# EAGLE design UPDuino Camera Adapter 2 himax (EAGLE 9.1.0)
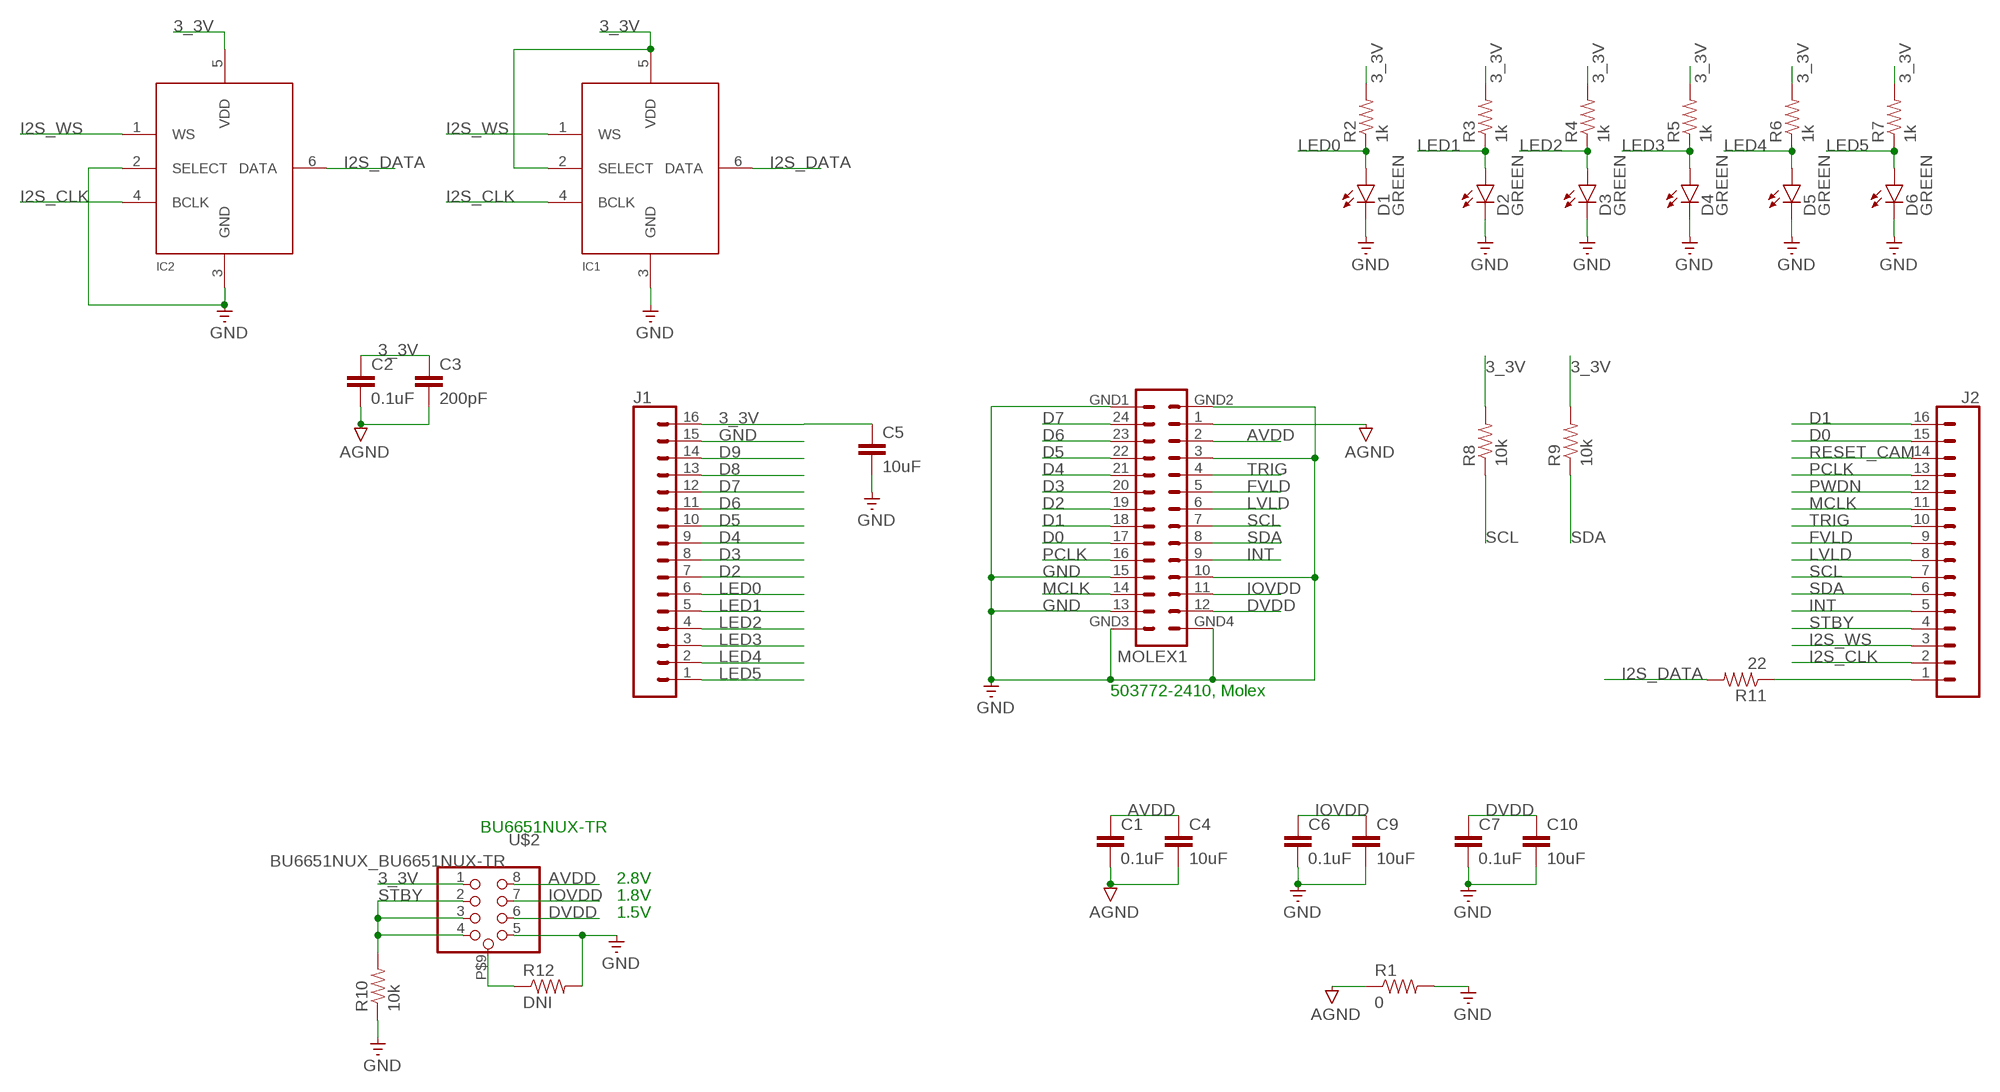
[diagram p0: schematic, sheet 1]

## Parts
C1  0.1uF  0.1UF-0603-25V-(+80/-20%)  [0603]
C2  0.1uF  0.1UF-0603-25V-(+80/-20%)  [0603]
C3  200pF  10UF-0603-6.3V-20%  [0603]
C4  10uF  10UF-0603-6.3V-20%  [0603]
C5  10uF  10UF-0603-6.3V-20%  [0603]
C6  0.1uF  0.1UF-0603-25V-(+80/-20%)  [0603]
C7  0.1uF  0.1UF-0603-25V-(+80/-20%)  [0603]
C9  10uF  10UF-0603-6.3V-20%  [0603]
C10  10uF  10UF-0603-6.3V-20%  [0603]
D1  GREEN  LED-GREEN0603  [LED-0603]
D2  GREEN  LED-GREEN0603  [LED-0603]
D3  GREEN  LED-GREEN0603  [LED-0603]
D4  GREEN  LED-GREEN0603  [LED-0603]
D5  GREEN  LED-GREEN0603  [LED-0603]
D6  GREEN  LED-GREEN0603  [LED-0603]
IC1  MIC_I2S_SPH0645  [SPH0645LM4H]
IC2  MIC_I2S_SPH0645  [SPH0645LM4H]
J1  CONN_16  [1X16]
J2  CONN_16  [1X16]
MOLEX1  MOLEX-5037722410_MOLEX  [MOLEX-5037722410_MOLEX]
R1  0  RESISTOR0603  [0603-RES]
R2  1k  RESISTOR0603  [0603-RES]
R3  1k  RESISTOR0603  [0603-RES]
R4  1k  RESISTOR0603  [0603-RES]
R5  1k  RESISTOR0603  [0603-RES]
R6  1k  RESISTOR0603  [0603-RES]
R7  1k  RESISTOR0603  [0603-RES]
R8  10k  RESISTOR0603  [0603-RES]
R9  10k  RESISTOR0603  [0603-RES]
R10  10k  RESISTOR0603  [0603-RES]
R11  22  RESISTOR0603  [0603-RES]
R12  DNI  RESISTOR0603  [0603-RES]
U$2  BU6651NUX_BU6651NUX-TR  [BU6651NUX_BU6651NUX-TR]

## Nets
3_3V: C2.1 C3.1 C5.1 IC1.2(SELECT) IC1.5(VDD) IC2.5(VDD) J1.16 R2.2 R3.2 R4.2 R5.2 R6.2 R7.2 R8.2 R9.2 U$2.1
AGND: C1.2 C2.2 C3.2 C4.2 MOLEX1.1 R1.1
AVDD [VCC2]: C1.1 C4.1 MOLEX1.2 U$2.8
D0: J2.15 MOLEX1.17
D1: J2.16 MOLEX1.18
D2: J1.7 MOLEX1.19
D3: J1.8 MOLEX1.20
D4: J1.9 MOLEX1.21
D5: J1.10 MOLEX1.22
D6: J1.11 MOLEX1.23
D7: J1.12 MOLEX1.24
D8: J1.13
D9: J1.14
DVDD: C7.1 C10.1 MOLEX1.12 U$2.6
FVLD: J2.9 MOLEX1.5
GND [default]: C5.2 C6.2 C7.2 C9.2 C10.2 D1.C D2.C D3.C D4.C D5.C D6.C IC1.3(GND) IC2.2(SELECT) IC2.3(GND) J1.15 MOLEX1.3 MOLEX1.10 MOLEX1.13 MOLEX1.15 MOLEX1.GND1 MOLEX1.GND2 MOLEX1.GND3 MOLEX1.GND4 R1.2 R10.1 R12.2 U$2.5
I2S_CLK: IC1.4(BCLK) IC2.4(BCLK) J2.2
I2S_DATA: IC1.6(DATA) IC2.6(DATA) R11.2
I2S_WS: IC1.1(WS) IC2.1(WS) J2.3
INT: J2.5 MOLEX1.9
IOVDD: C6.1 C9.1 MOLEX1.11 U$2.7
LED0: D1.A J1.6 R2.1
LED1: D2.A J1.5 R3.1
LED2: D3.A J1.4 R4.1
LED3: D4.A J1.3 R5.1
LED4: D5.A J1.2 R6.1
LED5: D6.A J1.1 R7.1
LVLD: J2.8 MOLEX1.6
MCLK: J2.11 MOLEX1.14
N$1: J2.1 R11.1
N$2: R12.1 U$2.P$9
PCLK: J2.13 MOLEX1.16
PWDN: J2.12
RESET_CAM: J2.14
SCL: J2.7 MOLEX1.7 R8.1
SDA: J2.6 MOLEX1.8 R9.1
STBY: J2.4 R10.2 U$2.2 U$2.3 U$2.4
TRIG: J2.10 MOLEX1.4

## Notes on the sheet
- 503772-2410, Molex
- BU6651NUX-TR
- 2.8V
- 1.8V
- 1.5V

## Library data of the parts
C1 C2 C6 C7 = SparkFun-Capacitors:0.1UF: 0.1µF ceramic capacitors A capacitor is a passive two-terminal electrical component used to store electrical energy temporarily in an electric field.; PROD_ID: CAP-00810
C3 = SparkFun-Capacitors:10UF: 10.0µF ceramic capacitors A capacitor is a passive two-terminal electrical component used to store electrical energy temporarily in an electric field.; PROD_ID: CAP-11015; VALUE: 10uF
C4 C5 C9 C10 = SparkFun-Capacitors:10UF: 10.0µF ceramic capacitors A capacitor is a passive two-terminal electrical component used to store electrical energy temporarily in an electric field.; PROD_ID: CAP-11015
D1-D6 = SparkFun-LED:LED-GREEN: Various green LEDs Green LEDs used in SFE Production 0603- DIO-00821 LARGE- DIO-00862 LILYPAD- DIO-09910; PROD_ID: DIO-00821
IC1 IC2 = microbuilder:MIC_I2S
J1 J2 = SparkFun-Connectors:CONN_16: Multi connection point. Often used as Generic Header-pin footprint for 0.1 inch spaced/style header connections On any of the 0.1 inch spaced packages, you can populate with these: Break Away Headers - Straight <https://www.sparkfun.com/products/116> (PRT-00116) Break Away Male Headers - Right Angle <https://www.sparkfun.com/products/553> (PRT-00553) Female Headers <https://www.sparkfun.com/products/115> (PRT-00115) Break Away Headers - Machine Pin <https://www.sparkfun.com/products/117> (PRT-00117) Break Away Female Headers - Swiss Machine Pin <https://www.sparkfun.com/products/743> (PRT-00743) For SCREWTERMINALS and SPRING TERMINALS visit here: Screw Terimnals on SparkFun.com <https://www.sparkfun.com/search/results?term=Screw+Terminals> (5mm/3.5mm/2.54mm spacing) This device is also useful as a general connection point to wire up your design to another part of your project. Our various solder wires solder well into these plated through hole pads. Hook-Up Wire - Assortment (Stranded, 22 AWG) <https://www.sparkfun.com/products/11375> (PRT-11375) Hook-Up Wire - Assortment (Solid Core, 22 AWG) <https://www.sparkfun.com/products/11367> (PRT-11367) View the entire wire category on our website here <https://www.sparkfun.com/categories/141> Special notes: Molex polarized connector foot print use with SKU : PRT-08231 with associated crimp pins and housings. 1MM SMD Version SKU: PRT-10208 NOTES ON THE VARIANTS LOCK and LOCK_LONGPADS... This footprint was designed to help hold the alignment of a through-hole component (i.e. 6-pin header) while soldering it into place. You may notice that each hole has been shifted either up or down by 0.005 of an inch from it's more standard position (which is a perfectly straight line). This slight alteration caused the pins (the squares in the middle) to touch the edges of the holes. Because they are alternating, it causes a "brace" to hold the component in place. 0.005 has proven to be the perfect amount of "off-center" position when using our standard breakaway headers. Although looks a little odd when you look at the bare footprint, once you have a header in there, the alteration is very hard to notice. Also,if you push a header all the way into place, it is covered up entirely on the bottom side.
MOLEX1 = molex:MOLEX-5037722410_MOLEX
R1-R12 = SparkFun-Resistors:RESISTOR: Resistor Basic schematic elements and footprints for 0603, 1206, and PTH resistors.
U$2 = UPDuino Camera Adapter 2 himax:BU6651NUX_BU6651NUX-TR

## Board
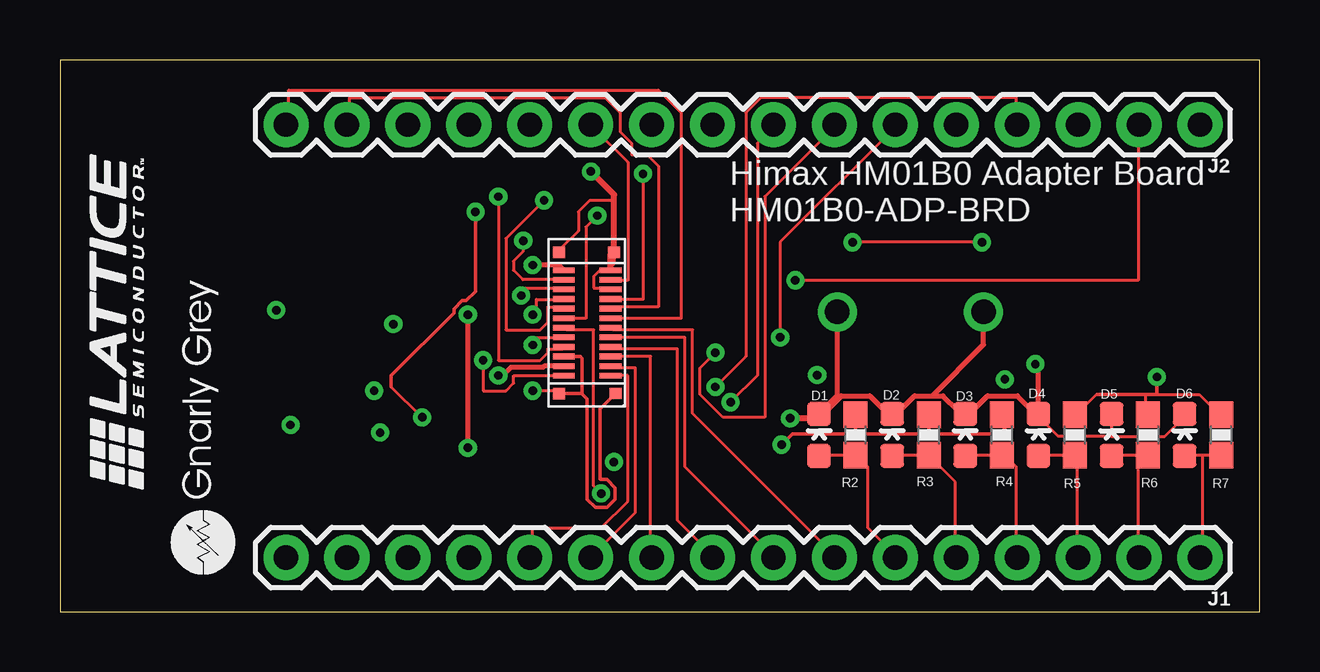
[diagram p1: board, top side]
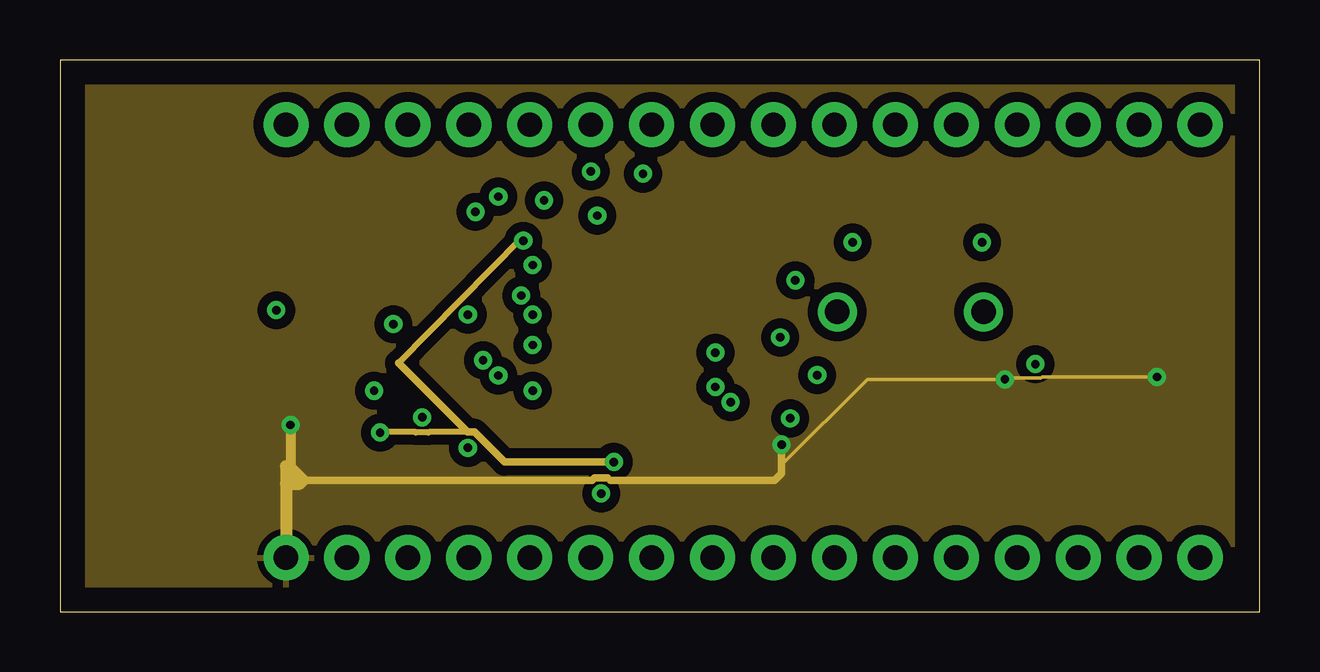
[diagram p2: board, inner layer vcc]
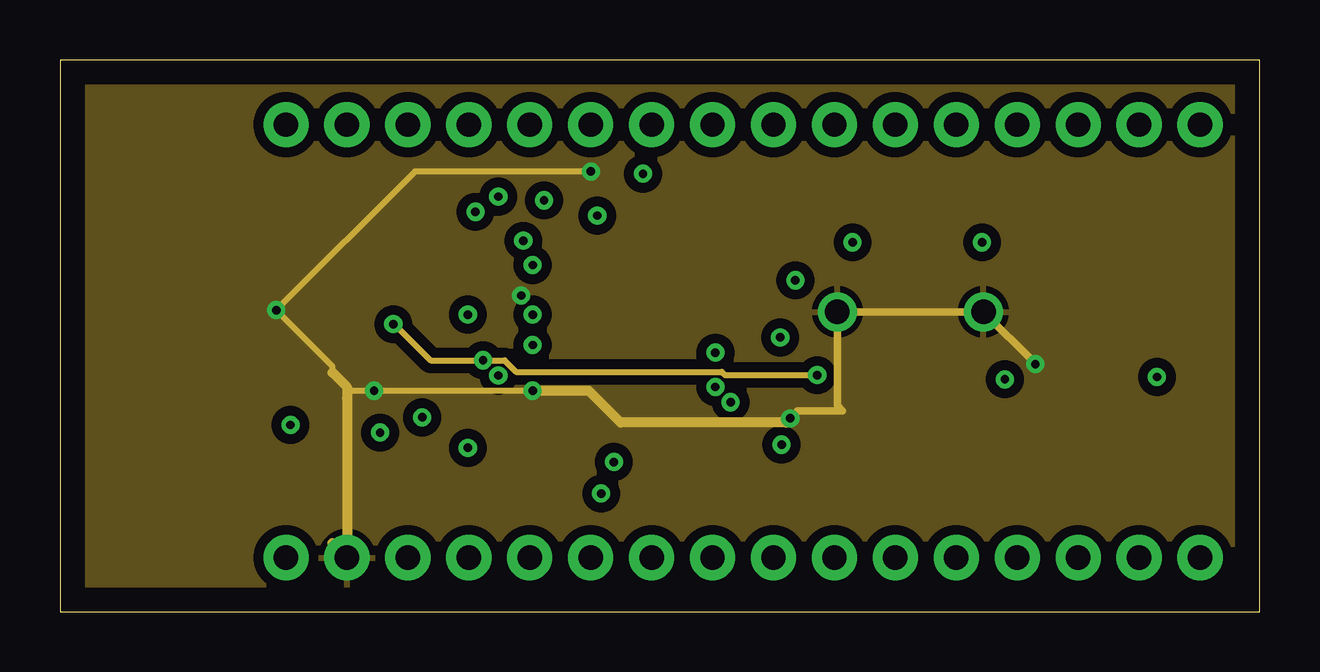
[diagram p3: board, inner layer gnd]
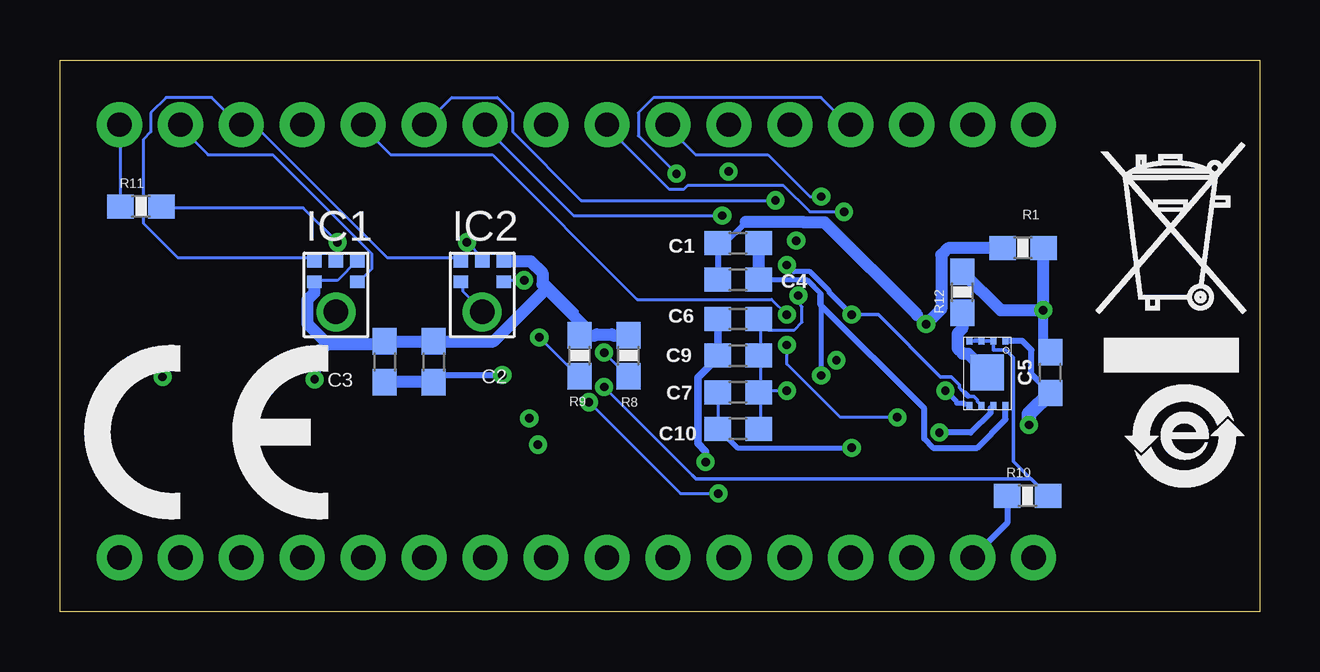
[diagram p4: board, bottom side, seen from below]

Size 50 x 23 mm. Coordinates in mm from the lower left corner, seen from the top.
Outline: 0,23 0,0 50,0 50,23 0,23
Copper layers (1*2+15*16): Top 0.035mm / dielectric 1.5mm / vcc 0.035mm / dielectric 0.8mm / gnd 0.035mm / dielectric 0.5mm / Bottom 0.035mm
Design rules "default *": minimum track width 5mil, minimum drill 0.35mm, track to track 5mil, track to pad 5mil, pad to pad 5mil, via to via 5mil, smd to smd 0mil, copper to edge 40mil, drill to drill 6mil, minimum pad ring 10mil, minimum via ring 8mil, stop-mask expansion 4mil, vias tented up to drill 0mil, thermal gap 10mil

### Footprints (pad centres in the part's own frame; a part is rotated, then mirrored left to right if it is on the bottom)
0603 = smd 1.1 x 1: 1 -0.85,0; 2 0.85,0
LED-0603 = smd 1 x 1: A 0,-0.877; C 0,0.877
SPH0645LM4H = smd 0.6 x 0.525: 1 -0.9,1.4; 2 -0.9,0.55; 4 0.9,0.55; 5 0.9,1.4; 6 0,1.4 | drill 1.025 pad 1.625: 3 0,-0.71
1X16 = drill 1.016 pad 1.88: 1 0,0; 2 2.54,0; 3 5.08,0; 4 7.62,0; 5 10.16,0; 6 12.7,0; 7 15.24,0; 8 17.78,0; 9 20.32,0; 10 22.86,0; 11 25.4,0; 12 27.94,0; 13 30.48,0; 14 33.02,0; 15 35.56,0; 16 38.1,0
MOLEX-5037722410_MOLEX = smd 0.24 x 0.9: 1 -1.6,0.95; 2 -1.2,0.95; 3 -0.8,0.95; 4 -0.4,0.95; 5 0,0.95; 6 0.4,0.95; 7 0.8,0.95; 8 1.2,0.95; 9 1.6,0.95; 10 2,0.95; 11 2.4,0.95; 12 2.8,0.95; 13 2.8,-1; 14 2.4,-1; 15 2,-1; 16 1.6,-1; 17 1.2,-1; 18 0.8,-1; 19 0.4,-1; 20 0,-1; 21 -0.4,-1; 22 -0.8,-1; 23 -1.2,-1; 24 -1.6,-1 | smd 0.47 x 0.5: GND1 -2.339,-1.202; GND2 3.55,-1.148; GND3 3.55,1.149; GND4 -2.35,1.15
0603-RES = smd 1.1 x 1: 1 -0.85,0; 2 0.85,0
BU6651NUX_BU6651NUX-TR = smd 0.3 x 0.25: 1 0.148,1.749; 2 0.148,1.249; 3 0.148,0.749; 4 0.148,0.249; 5 2.836,0.249; 6 2.836,0.749; 7 2.836,1.249; 8 2.836,1.749 | smd 1.5 x 1.4: P$9 1.47,0.976

### Placement (x,y rotation side)
C1  21.73,15.37 180 bottom
C2  34.43,10.41 270 bottom
C3  36.46,10.41 270 bottom
C4  21.73,13.84 180 bottom
C5  8.73,9.97 90 bottom
C6  21.73,12.19 0 bottom
C7  21.73,9.14 0 bottom
C9  21.73,10.67 0 bottom
C10  21.73,7.62 0 bottom
D1  31.64,7.37 0 top
D2  34.69,7.37 0 top
D3  37.73,7.37 0 top
D4  40.78,7.37 0 top
D5  43.83,7.37 0 top
D6  46.88,7.37 0 top
IC1  38.5,13.21 0 bottom
IC2  32.4,13.21 0 bottom
J1  47.52,2.25 180 top
J2  47.52,20.3 180 top
MOLEX1  21.95,11.43 90 top
R1  9.86,15.15 0 bottom
R2  33.16,7.37 90 top
R3  36.21,7.37 90 top
R4  39.26,7.37 90 top
R5  42.31,7.37 90 top
R6  45.35,7.37 90 top
R7  48.4,7.37 90 top
R8  26.3,10.67 90 bottom
R9  28.34,10.67 90 bottom
R10  9.67,4.83 0 bottom
R11  46.62,16.89 0 bottom
R12  12.39,13.31 90 bottom
U$2  12.33,11.43 270 bottom

### Tracks (layer width: path | path; a pad name or v marks a point on that pad's centre or on a via)
3_3V  (via drill 0.35)
  Top 0.127: 45.26,9.05 43.22,9.05 43.2,9.05 42.4,8.26 R5.2 | 45.26,9.05 45.26,8.26 R6.2 | 45.26,9.05 47.48,9.05 48.27,8.26 R7.2 | 39.38,8.35 39.38,8.26 R4.2
  Top 0.152: v30.08,6.96 30.53,7.41 33.06,7.41 | 33.06,7.41 36.08,7.41 | 36.08,7.41 39.16,7.41 39.38,7.63 39.38,8.35 | 36.08,7.41 36.21,7.54 R3.2 | 33.06,7.41 33.16,7.51 R2.2 | v45.72,9.78 45.72,9.05 43.22,9.05
  vcc 0.152: 30.08,6.11 33.65,9.68 v39.38,9.68 39.44,9.74 40.9,9.74 40.94,9.78 v45.72,9.78
  vcc 0.305: 10.13,5.47 22.18,5.47 22.29,5.58 22.83,5.58 22.94,5.47 29.78,5.47 30.08,5.77 30.08,6.11 v30.08,6.96
  vcc 0.406: v9.61,7.78 9.61,5.99
  vcc 0.508: 9.42,5.33 9.42,6.06 9.54,6.06 9.61,5.99 10.13,5.47 9.99,5.33 9.42,5.33 | 9.42,5.33 J1.16
  Bottom 0.127: 29.54,13.65 28.43,12.54 28.43,11.59 R9.2 28.27,11.59 28.22,11.59 26.37,11.59 R8.2 | 29.54,13.65 30.5,14.61 31.45,14.61 IC2.5 | IC1.2 39.38,13.81 38.43,13.81 37.64,14.61 IC1.5 | 36.51,11.16 C3.1 36.37,11.27 34.46,11.27 C2.1 34.3,11.27 31.92,11.27 29.72,13.47 29.54,13.65
  Bottom 0.254: v9.61,7.78 9.77,7.78 | C5.1 9.51,9.9 9.51,10.9 9.89,11.28 U$2.1
  Bottom 0.508: IC1.2 39.4,13.29 39.69,12.99 39.69,12 38.85,11.16 | 38.85,11.16 36.51,11.16 | C3.1 31.93,11.26 29.72,13.47 | 29.72,13.47 28.22,11.97 28.22,11.59 | R9.2 27.67,11.52 27.63,11.55 27.01,11.55 26.97,11.52 R8.2 | 29.72,13.47 29.89,13.65 29.89,14.13 30.38,14.61 IC2.5 | 38.85,11.16 39.38,10.63 v39.38,9.68
  Bottom 0.61: C5.1 9.61,8.23 v9.61,7.78
  pour vcc (isolate 0.406): 0.13,0 50.04,0 50.04,23.11 0.13,23.11
AGND  (via drill 0.35)
  Top 0.127: v17.64,10.48 17.64,9.21 18.59,9.21 18.91,9.53 18.91,9.84 20.97,9.84 MOLEX1.1
  gnd 0.254: v13.9,11.98 13.95,11.93 13.98,11.93 15.44,10.48 v17.64,10.48 v17.64,10.47 18.53,10.47 19.01,10 27.58,10 27.72,9.86 v31.56,9.86
  Bottom 0.127: 11.18,14.71 R1.1 | 22.24,15.4 22.53,15.4 22.56,15.4 C1.2
  Bottom 0.152: 21.41,16.25 21.41,16.12
  Bottom 0.254: v13.9,11.99 v13.9,11.98 14.27,12.36 | 22.53,15.4 22.26,15.4 21.54,16.12 21.41,16.12 | C1.2 C4.2 | C2.2 34.14,9.86 v31.56,9.86 31.41,9.86
  Bottom 0.508: v13.9,11.98 13.27,12.61 13.27,14.87 12.98,15.15 R1.1 | 21.41,16.25 19.02,16.25 18.99,16.22 18.13,16.22 14.27,12.36 | C2.2 C3.2
AVDD  (via drill 0.35)
  Top 0.203: MOLEX1.2 20.19,10.23 20.14,10.19 18.79,10.19 18.45,9.84 v18.27,9.84
  Bottom 0.127: 18.59,13.49 18.91,13.81 20.81,13.81 C4.1 20.81,13.97 20.81,15.24 C1.1
  Bottom 0.152: U$2.8 10.59,8.41 | 18.27,13.24 18.3,13.21 18.3,13.07
  Bottom 0.203: C4.1 19.95,13.84 18.87,13.84 18.27,13.24 v18.27,9.84
  Bottom 0.254: 18.3,13.23 18.3,13.07 18.3,12.78 13.98,8.46 13.98,7.2 13.61,6.83 11.77,6.83 10.59,8.02 10.59,8.41 U$2.8
  Bottom 0.508: C1.1 C4.1
D0
  Top 0.127: MOLEX1.17 23.03,12.7 24.94,12.7 24.94,18.57 24.46,19.05 23.83,19.05 23.83,19.53 23.35,20 23.35,20.8 22.72,21.43 12.08,21.43 12.08,20.32 J2.15
D1
  Top 0.127: MOLEX1.18 23.03,12.22 25.89,12.22 25.89,20.8 24.94,21.75 9.54,21.75 9.54,20.32 J2.16
D2
  Top 0.127: MOLEX1.19 23.03,11.75 26.37,11.75 26.37,8.26 32.24,2.38 J1.7
D3
  Top 0.127: MOLEX1.20 23.03,11.43 26.05,11.43 26.05,6.03 29.7,2.38 J1.8
D4
  Top 0.127: MOLEX1.21 23.03,10.95 25.73,10.95 25.73,3.81 27.16,2.38 J1.9
D5
  Top 0.127: MOLEX1.22 23.03,10.64 24.62,10.64 24.62,2.38 J1.10
D6
  Top 0.127: MOLEX1.23 23.03,10.16 23.99,10.16 23.99,4.13 22.24,2.38 J1.11
D7
  Top 0.127: MOLEX1.24 23.03,9.84 23.67,9.84 23.67,4.6 22.56,3.49 19.7,3.49 19.7,2.38 J1.12
DVDD  (via drill 0.35)
  Top 0.203: v17,6.83 v17,12.38 | MOLEX1.12 20.79,14.45 v19.7,14.45
  Bottom 0.127: 22.56,7.62 22.56,9.05 C7.1
  Bottom 0.152: U$2.6 11.76,8.77 11.76,8.83 11.9,8.97 12.14,8.97 | 12.29,9.12 12.44,9.27 12.51,9.34 12.51,9.45 12.85,9.79 13.29,9.79 15.89,12.38 v17,12.38
  Bottom 0.203: C10.1 22.56,7.62 21.76,6.83 v17,6.83 16.96,6.87 | v19.7,14.45 19.42,14.17 18.73,14.17 17.94,13.38 17.94,13.32 v17,12.38 | 12.14,8.97 12.29,9.12
FVLD  (via drill 0.35)
  Top 0.127: v19.7,11.11 19.7,11.43 20.97,11.43 MOLEX1.5 | 13.81,9.37 15.08,8.1 v15.1,8.1 | 17.32,16.6 v17.32,16.67
  Top 0.152: 13.81,9.37 13.81,9.84 16.42,12.45 16.42,12.62 16.76,12.96 16.94,12.96 17.32,13.35 17.32,16.6
  Bottom 0.127: v19.7,11.11 19.7,10.32 17.48,8.1 v15.1,8.1 | v17.32,16.67 18.75,16.67 19.86,17.78 23.83,17.78 23.99,17.62 24.62,17.62 27.16,20.16 J2.9
GND  (via drill 0.35)
  Top 0.127: 31.77,8.26 D1.C | 34.62,8.26 D2.C 34.78,8.26 | 43.83,7.3 41.61,7.3 40.92,7.99 40.81,8.1 D4.C | D5.C 43.83,7.3 | 43.83,7.3 46.05,7.3 46.85,8.1 D6.C | 37.92,8.38 37.8,8.26 D3.C | v19.22,13.18 19.22,13.49 20.97,13.49 MOLEX1.10 | v19.7,9.21 20.65,9.21 MOLEX1.GND4 | MOLEX1.GND3 20.81,15.08 21.61,15.88 21.61,16.67 22.08,17.14 23.03,17.14 23.03,15.08 MOLEX1.GND2 | 22.88,13.49 22.67,13.49 22.24,13.49 22.24,13.97 22.56,14.29 22.88,14.29 MOLEX1.13
  Top 0.152: MOLEX1.GND1 22.51,8.45 22.51,5.54 22.54,5.5 22.8,5.5 23.14,5.16 23.14,4.68 22.8,4.34 22.32,4.34 21.97,4.68 21.97,8.86 21.74,9.08 | 21.74,9.08 MOLEX1.GND4 | MOLEX1.3 21.69,10.63 21.76,10.56 21.76,9.1 21.74,9.08 | MOLEX1.GND2 23.09,14.51 22.88,14.29 | MOLEX1.15 22.89,13.49 22.67,13.49
  Top 0.203: 34.78,8.26 34.5,8.26 33.76,8.99 32.57,8.99 31.82,8.24 D1.C 32.4,9.01 IC2.3 | 36.36,8.99 35.61,8.99 34.86,8.24 D2.C | 36.36,8.99 36.8,8.99 37.42,8.38 37.92,8.38 | D3.C 37.91,8.24 38.66,8.99 39.91,8.99 40.92,7.99 | D4.C 40.78,10.19 v40.66,10.32 | 36.36,8.99 38.5,11.13 IC1.3
  Top 0.254: D1.C arc-90 31.45,8.05 v30.44,8.05 | MOLEX1.GND2 23.09,15.02 | 23.09,15.02 23.09,17.39 v22.13,18.35 | MOLEX1.13 22.95,14.88 23.09,15.02
  gnd 0.203: 12.07,9.21 11.96,9.1 11.96,8.89
  gnd 0.254: 11.36,9.96 11.36,10.23 v9.01,12.57 14.79,18.35 v22.13,18.35 | v19.7,9.21 v13.09,9.21 12.2,9.21 | 12.07,9.21 12.2,9.21 | 12.2,9.21
  gnd 0.305: v30.44,8.05 30.75,8.37 32.62,8.37 32.4,8.59 IC2.3 IC1.3 40.66,10.34 v40.66,10.32
  gnd 0.406: 11.36,2.85 J1.15 11.96,8.89 11.96,9.36 11.36,9.96 | v30.44,8.05 30.26,7.88 23.37,7.88 22.04,9.21 v19.7,9.21
  Bottom 0.127: IC2.2 33.19,13.65 33.19,13.34 32.4,12.54 IC2.3 | C10.2 20.81,7.62 20.81,9.05 C7.2 20.81,9.21 | v19.22,13.18 19.22,12.86 19.06,12.7 19.06,12.06 19.38,11.75 20.49,11.75 20.81,12.06 | 20.81,12.06 20.81,10.79 C9.2 20.81,10.64 20.81,9.21 | 20.81,12.06 C6.2 | v19.7,9.21 20.81,9.21
  Bottom 0.203: U$2.5 12.13,8.64 12.28,8.64 12.32,8.68 12.62,8.68 12.62,8.74 v13.09,9.21
  Bottom 0.254: R1.2 9.01,14.87 | R10.1 10.52,3.69 J1.15
  Bottom 0.406: C5.2 9.01,11.11 v9.01,12.57
  Bottom 0.508: R12.2 10.79,12.57 v9.01,12.57 9.01,14.87
  pour gnd (isolate 0.406): 0.25,0 50.16,0 50.16,23.11 0.25,23.11
I2S_CLK  (via drill 0.35)
  Top 0.127: v30.65,13.81 44.94,13.81 44.94,20.16 J2.2
  Bottom 0.127: v30.65,13.81 31.45,13.81 IC2.4 | IC1.4 37.48,13.81 37,14.29 37,14.92 41.13,19.05 43.83,19.05 44.94,20.16 J2.2
I2S_DATA  (via drill 0.35)
  Top 0.127: v38.43,15.4 v33.03,15.4
  Bottom 0.127: v33.03,15.4 32.4,14.76 IC2.6 | IC1.6 38.43,14.76 v38.43,15.4 39.86,16.83 45.73,16.83 R11.2
I2S_WS
  Bottom 0.127: IC2.1 33.35,14.76 36.37,14.76 41.77,20.16 42.4,20.16 J2.3 42.56,20.32 43.67,21.43 45.58,21.43 46.21,20.8 46.21,20 46.53,19.68 46.53,16.19 45.1,14.76 39.54,14.76 IC1.1
INT  (via drill 0.35)
  Top 0.127: v19.7,12.38 19.86,12.54 19.86,13.02 20.97,13.02 MOLEX1.9
  Bottom 0.127: v19.7,12.38 20.34,13.02 25.95,13.02 31.98,19.05 36.21,19.05 37.32,20.16 J2.5
IOVDD  (via drill 0.35)
  Top 0.127: v19.31,15.46 19.31,15.02 18.9,14.61 18.9,14.23 19.3,13.83 MOLEX1.11
  vcc 0.254: 14.11,10.36 19.24,15.57 19.24,15.46 v19.31,15.46 | 16.98,7.48 15.38,7.48 15.36,7.46 14.83,7.46 14.82,7.48 13.39,7.48 13.34,7.44 v13.34,7.46
  vcc 0.305: 14.11,10.36 16.98,7.48 17.27,7.48 18.52,6.24 v23.09,6.24
  Bottom 0.152: 11.21,8.47 U$2.7
  Bottom 0.254: 11.21,8.47 11.21,8.3 12.04,7.46 v13.34,7.46
  Bottom 0.305: C6.1 C9.1 22.58,10.59 23.41,9.76 23.41,7 23.09,6.68 v23.09,6.24
LED0
  Top 0.127: D1.A 31.77,6.51 33.03,6.51 R2.1 33.19,6.51 33.67,6.03 33.67,3.49 34.78,2.38 J1.6
LED1
  Top 0.127: R3.1 34.78,6.51 D2.A | R3.1 37.32,5.4 37.32,2.38 J1.5 | R3.1
LED2
  Top 0.127: D3.A 37.8,6.51 39.23,6.51 R4.1 39.38,6.51 39.86,6.03 39.86,2.38 J1.4
LED3
  Top 0.127: D4.A 40.81,6.51 42.24,6.51 R5.1 42.4,6.51 42.4,2.38 J1.3
LED4
  Top 0.127: 44.94,6.51 45.26,6.51 R6.1 44.94,6.51 | 44.94,6.51 43.83,6.51 D5.A | 44.94,6.51 44.94,2.38 J1.2
LED5
  Top 0.127: 47.64,6.51 48.27,6.51 R7.1 | 47.64,6.51 47.01,6.51 D6.A | 47.64,6.51 47.64,2.38 J1.1
LVLD  (via drill 0.35)
  Top 0.127: v22.56,4.92 22.24,5.24 22.24,11.75 21.13,11.75 MOLEX1.6 | v27.95,8.73 29.07,9.84 29.07,19.53 29.7,20.16 J2.8
  Bottom 0.127: v22.56,4.92 24.14,4.92 v27.95,8.73
MCLK
  Top 0.127: MOLEX1.14 23.03,13.81 23.67,13.81 23.67,18.73 22.24,20.16 J2.11
N$1
  Bottom 0.127: R11.1 47.48,16.99 47.48,20.16 J2.1
N$2
  Bottom 0.508: R12.1 12.39,11.79 12.59,11.59 12.59,10.97 12.37,10.75 12.15,10.75 U$2.P$9
PCLK  (via drill 0.35)
  Top 0.127: v24.3,18.26 24.3,13.02 23.03,13.02 MOLEX1.16
  Bottom 0.127: v24.3,18.26 25.89,19.84 25.89,20.8 25.26,21.43 18.27,21.43 17.16,20.32 J2.13
SCL  (via drill 0.35)
  Top 0.127: v22.4,16.51 21.92,16.03 21.92,12.22 21.13,12.22 MOLEX1.7 | v27.32,10.79 26.68,10.16 26.68,9.05 27.64,8.1 29.38,8.1 29.38,17.3 32.24,20.16 J2.7
  Bottom 0.127: v22.4,16.51 28.59,16.51 32.24,20.16 J2.7 | v27.32,10.79 26.37,9.84 R8.1
SDA  (via drill 0.35)
  Top 0.127: v20.18,17.14 18.59,15.56 18.59,11.75 20.02,11.75 20.34,12.06 20.34,12.7 20.97,12.7 MOLEX1.8 | v30.02,11.43 30.02,15.4 34.78,20.16 J2.6
  Bottom 0.127: v20.18,17.14 28.27,17.14 31.13,20 31.13,20.8 31.77,21.43 33.67,21.43 34.78,20.32 J2.6 | v30.02,11.43 28.43,9.84 R9.1
STBY  (via drill 0.35)
  Top 0.127: v27.32,9.37 28.59,10.64 28.59,20.8 29.23,21.43 39.86,21.43 39.86,20.32 J2.4
  Bottom 0.127: v27.32,9.37 23.63,5.67 23.51,5.56
  Bottom 0.152: 23.63,5.67 23.48,5.53 9.52,5.53 R10.2 10.26,6.27 10.26,10.6 10.57,10.91 11.09,10.91 U$2.2 U$2.3 11.64,11.33 11.87,11.33 11.92,11.28 U$2.4 U$2.3
TRIG  (via drill 0.35)
  Top 0.127: v18.27,17.3 18.27,10.48 20.02,10.48 20.34,10.79 20.34,10.95 20.97,10.95 MOLEX1.4
  Bottom 0.127: v18.27,17.3 18.75,17.3 20.49,19.05 23.51,19.05 24.62,20.16 J2.10

### Text on the board
tPlace: Himax HM01B0 Adapter Board / HM01B0-ADP-BRD | /Users/grant/Downloads/logo-2.bmp